# Altium project PCB_Project_4.PrjPcb
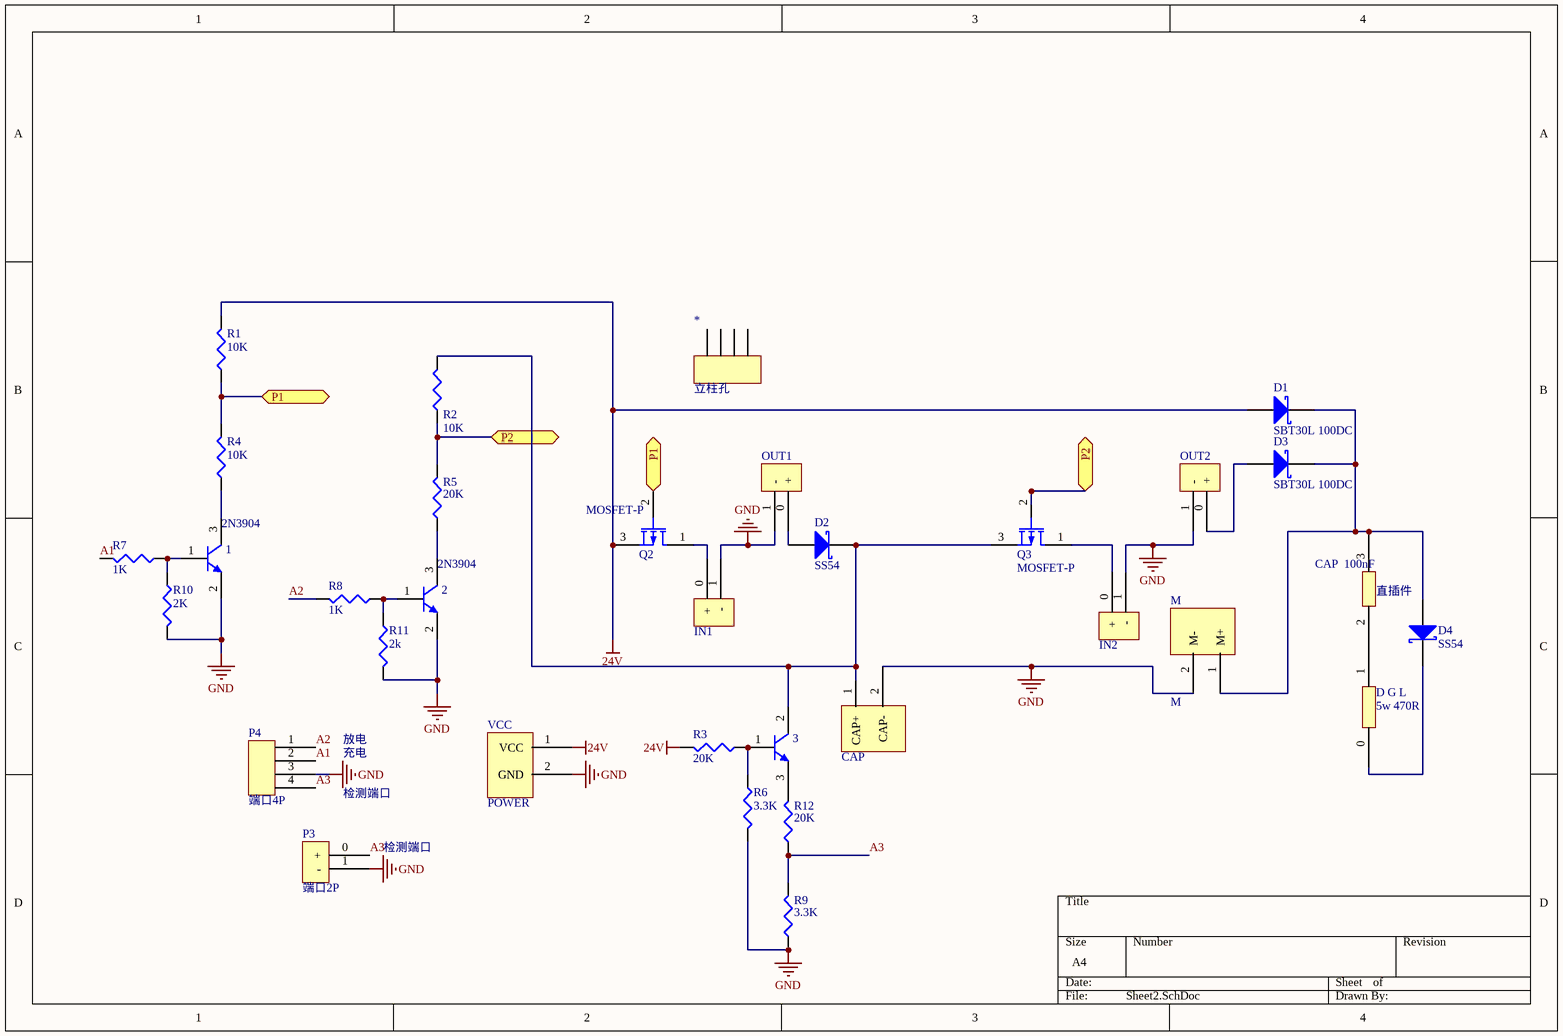
[diagram p0: Sheet2.SchDoc]
1 sheet, 33 parts. Net scope: flat (ports and power ports of the same name join across sheets).
Board file: PCB2.PcbDoc

## Sheet Sheet2.SchDoc
size A4

### Parts
1  2N3904  [SOT-23R]
2  2N3904  [SOT-23R]
3  (no value)  [SOT-23R]
*  立柱孔  [立柱孔]
CAP  (no value)  [POWER]
CAP_100nF  直插件  [直插件]
D1  SBT30L 100DC  [SMA(DO-214AC)_S2]
D2  SS54  [SMA(DO-214AC)_S2]
D3  SBT30L 100DC  [SMA(DO-214AC)_S2]
D4  SS54  [SMA(DO-214AC)_S2]
D_G_L  5w 470R  [大功率电阻]
IN1  (no value)  [焊盘2P]
IN2  (no value)  [焊盘2P]
M  M  [POWER]
OUT1  (no value)  [焊盘2P]
OUT2  (no value)  [焊盘2P]
P3  端口2P  [端口2P]
P4  端口4P  [端口4P]
Q2  MOSFET-P  [TO-252]
Q3  MOSFET-P  [TO-252]
R1  value 10K  [0805]  (hidden comment: Res（0402-5205）)
R2  value 10K  [0805]  (hidden comment: Res（0402-5205）)
R3  value 20K  [0805]  (hidden comment: Res（0402-5205）)
R4  value 10K  [0805]  (hidden comment: Res（0402-5205）)
R5  value 20K  [0805]  (hidden comment: Res（0402-5205）)
R6  value 3.3K  [0805]  (hidden comment: Res（0402-5205）)
R7  value 1K  [0805]  (hidden comment: Res（0402-5205）)
R8  value 1K  [0805]  (hidden comment: Res（0402-5205）)
R9  value 3.3K  [0805]  (hidden comment: Res（0402-5205）)
R10  value 2K  [0805]  (hidden comment: Res（0402-5205）)
R11  value 2k  [0805]  (hidden comment: Res（0402-5205）)
R12  value 20K  [0805]  (hidden comment: Res（0402-5205）)
VCC  POWER  [POWER]

### Ports
P1, P2

### Nets
24V: D1.1(A) Q2.3(S) R1.2 R3.2 VCC.1(VCC)
GND: 1.2(E) 2.2(E) CAP.2(CAP-) IN1.1(-) IN2.1(-) M.2(M-) OUT1.1(-) OUT2.1(-) P3.1(-) P4.3 R6.2 R9.1 R10.2 R11.2 VCC.2(GND)
A1: P4.2 R7.2
A2: P4.1 R8.2
A3: P3.0(+) P4.4 R9.2 R12.1
Net1_1: 1.1(B) R7.1 R10.1
Net1_3: 1.3(C) R4.1
Net2_1: 2.1(B) R8.1 R11.1
Net2_3: 2.3(C) R5.1
Net3_1: 3.1(B) R3.1 R6.1
Net3_2: 3.2(C) CAP.1(CAP+) D2.2(K) Q3.3(S) R2.2
Net3_3: 3.3(E) R12.2
NetCAP_100nF_2: CAP_100nF.2 D_G_L.1
NetCAP_100nF_3: CAP_100nF.3 D1.2(K) D3.2(K) D4.1(A) M.1(M+)
NetD2_1: D2.1(A) OUT1.0(+)
NetD3_1: D3.1(A) OUT2.0(+)
NetD4_2: D4.2(K) D_G_L.0
NetIN1_0: IN1.0(+) Q2.1(D)
NetIN2_0: IN2.0(+) Q3.1(D)
NetQ2_2: Q2.2(G) R1.1 R4.2 ; port P1
NetQ3_2: Q3.2(G) R2.1 R5.2 ; port P2

### Notes on the sheet
- 充电
- 放电
- 检测端口

### Library data of the parts
1-3 = 2N3904: NPN General Purpose Amplifier; Published: 8-Jun-2000; LatestRevisionDate: 15-Jan-2003; LatestRevisionNote: PCB Footprint 'BCY-W3/D4.7' replaced; DatasheetVersion: 1997; PackageVersion: Sep-1998; PackageReference: TO-92A; Publisher: Altium Limited; PackageDescription: TO, Flat Index; 3 In-Line, Axial Leads; Body Dia. 4.5mm; Leads 0.51 x 0.48 mm (max); ComponentLink1Description: Manufacturer Link; ComponentLink1URL: http://www.fairchildsemi.com/; ComponentLink2Description: Datasheet; ComponentLink2URL: http://www.fairchildsemi.com/ds/2N%2F2N3904.pdf
CAP M = POWER
D1-D4 = D Schottky-SMA: DO-214AC/SMA; Published: 8-Jun-2000; LatestRevisionDate: 17-Jul-2002; LatestRevisionNote: Re-released for DXP Platform.; PackageReference: SMB; Publisher: Altium Limited; PackageDescription: DO-214-AA/SMB; 2 C-Bend Leads; Body 5.3 x 3.6 mm, inc. leads (LxW); Code_JEDEC: DO-214-AA
D_G_L = 大功率电阻
IN1 IN2 OUT1 OUT2 = 焊盘2P
Q2 Q3 = MOSFET-P: P-Channel MOSFET; Published: 8-Jun-2000; LatestRevisionDate: 17-Jul-2002; LatestRevisionNote: Re-released for DXP Platform.; PackageVersion: 1995/1996; PackageReference: E3; Publisher: Altium Limited; PackageDescription: TO, Flat Index; 3 In-Line, Axial Leads; Body Dia. 4.6mm; Lead Dia. 0.5 mm (max)
R1-R12 = Res（0402-5205）: Resistor; Published: 8-Jun-2000; LatestRevisionDate: 29-May-2009; LatestRevisionNote: IPC-7351 Footprint Added.; PackageReference: J1-0603; Publisher: Altium Limited; PackageDescription: Chip Resistor